# Altium project Project_dot_machne.PrjPcb
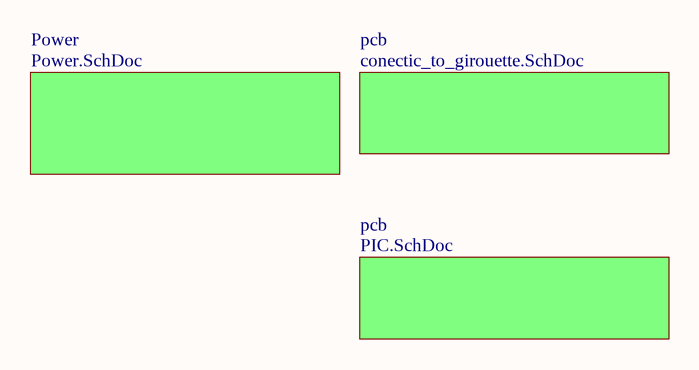
[diagram p0: Sheet1.SchDoc]
4 sheets, 29 parts. Net scope: global (net labels, ports and power ports of the same name join across sheets).
Board files: PCB1.PcbDoc, PCB2.PcbDoc
Sheets:
  Sheet1.SchDoc
    Power = Power.SchDoc
    pcb = conectic_to_girouette.SchDoc
    pcb = PIC.SchDoc

## Sheet Sheet1.SchDoc
size A

### Sub-sheets
pcb = conectic_to_girouette.SchDoc: no entries
pcb = PIC.SchDoc: no entries
Power = Power.SchDoc: no entries

## Sheet Power.SchDoc
size A
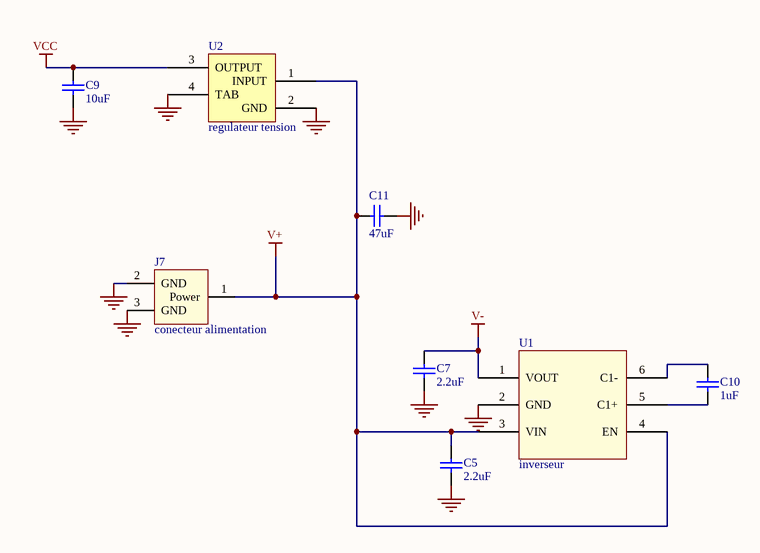
[diagram p1: Power.SchDoc]

### Parts
C5  2.2uF  [CAPC1608X09N]
C7  2.2uF  [CAPC1608X09N]
C9  10uF  [CAPC1608X09N]
C10  1uF  [CAPC1608X09N]
C11  47uF  [CAPC1608X09N]
J7  conecteur alimentation
U1  inverseur
U2  regulateur tension  [SOT230P710X180-4N]

### Nets
GND: C5.1 C7.1 C9.1 C11.1 J7.2(GND) J7.3(GND) U1.2(GND) U2.2(GND) U2.4(TAB)
V+: C5.2 C11.2 J7.1(Power) U1.3(VIN) U1.4(EN) U2.1(INPUT)
V-: C7.2 U1.1(VOUT)
VCC: C9.2 U2.3(OUTPUT)
NetC10_1: C10.1 U1.6(C1-)
NetC10_2: C10.2 U1.5(C1+)

### Library data of the parts
C5 C7 C9-C11 = Cap: Capacitor; Value: 0.1uf; Published: 8-Jun-2000; LatestRevisionDate: 17-Jul-2002; LatestRevisionNote: Re-released for DXP Platform.; PackageReference: RAD-0.3; Publisher: Altium Limited; PackageDescription: Radial Cap, Thru-Hole; 2 Leads; 0.3 in Pin Spacing
U2 = regulateur tension: fournisseur: farnell; Ref fournisseur: 2510013; Ref fabricant: MIC2920A-3.3WS-TR

## Sheet conectic_to_girouette.SchDoc
size B
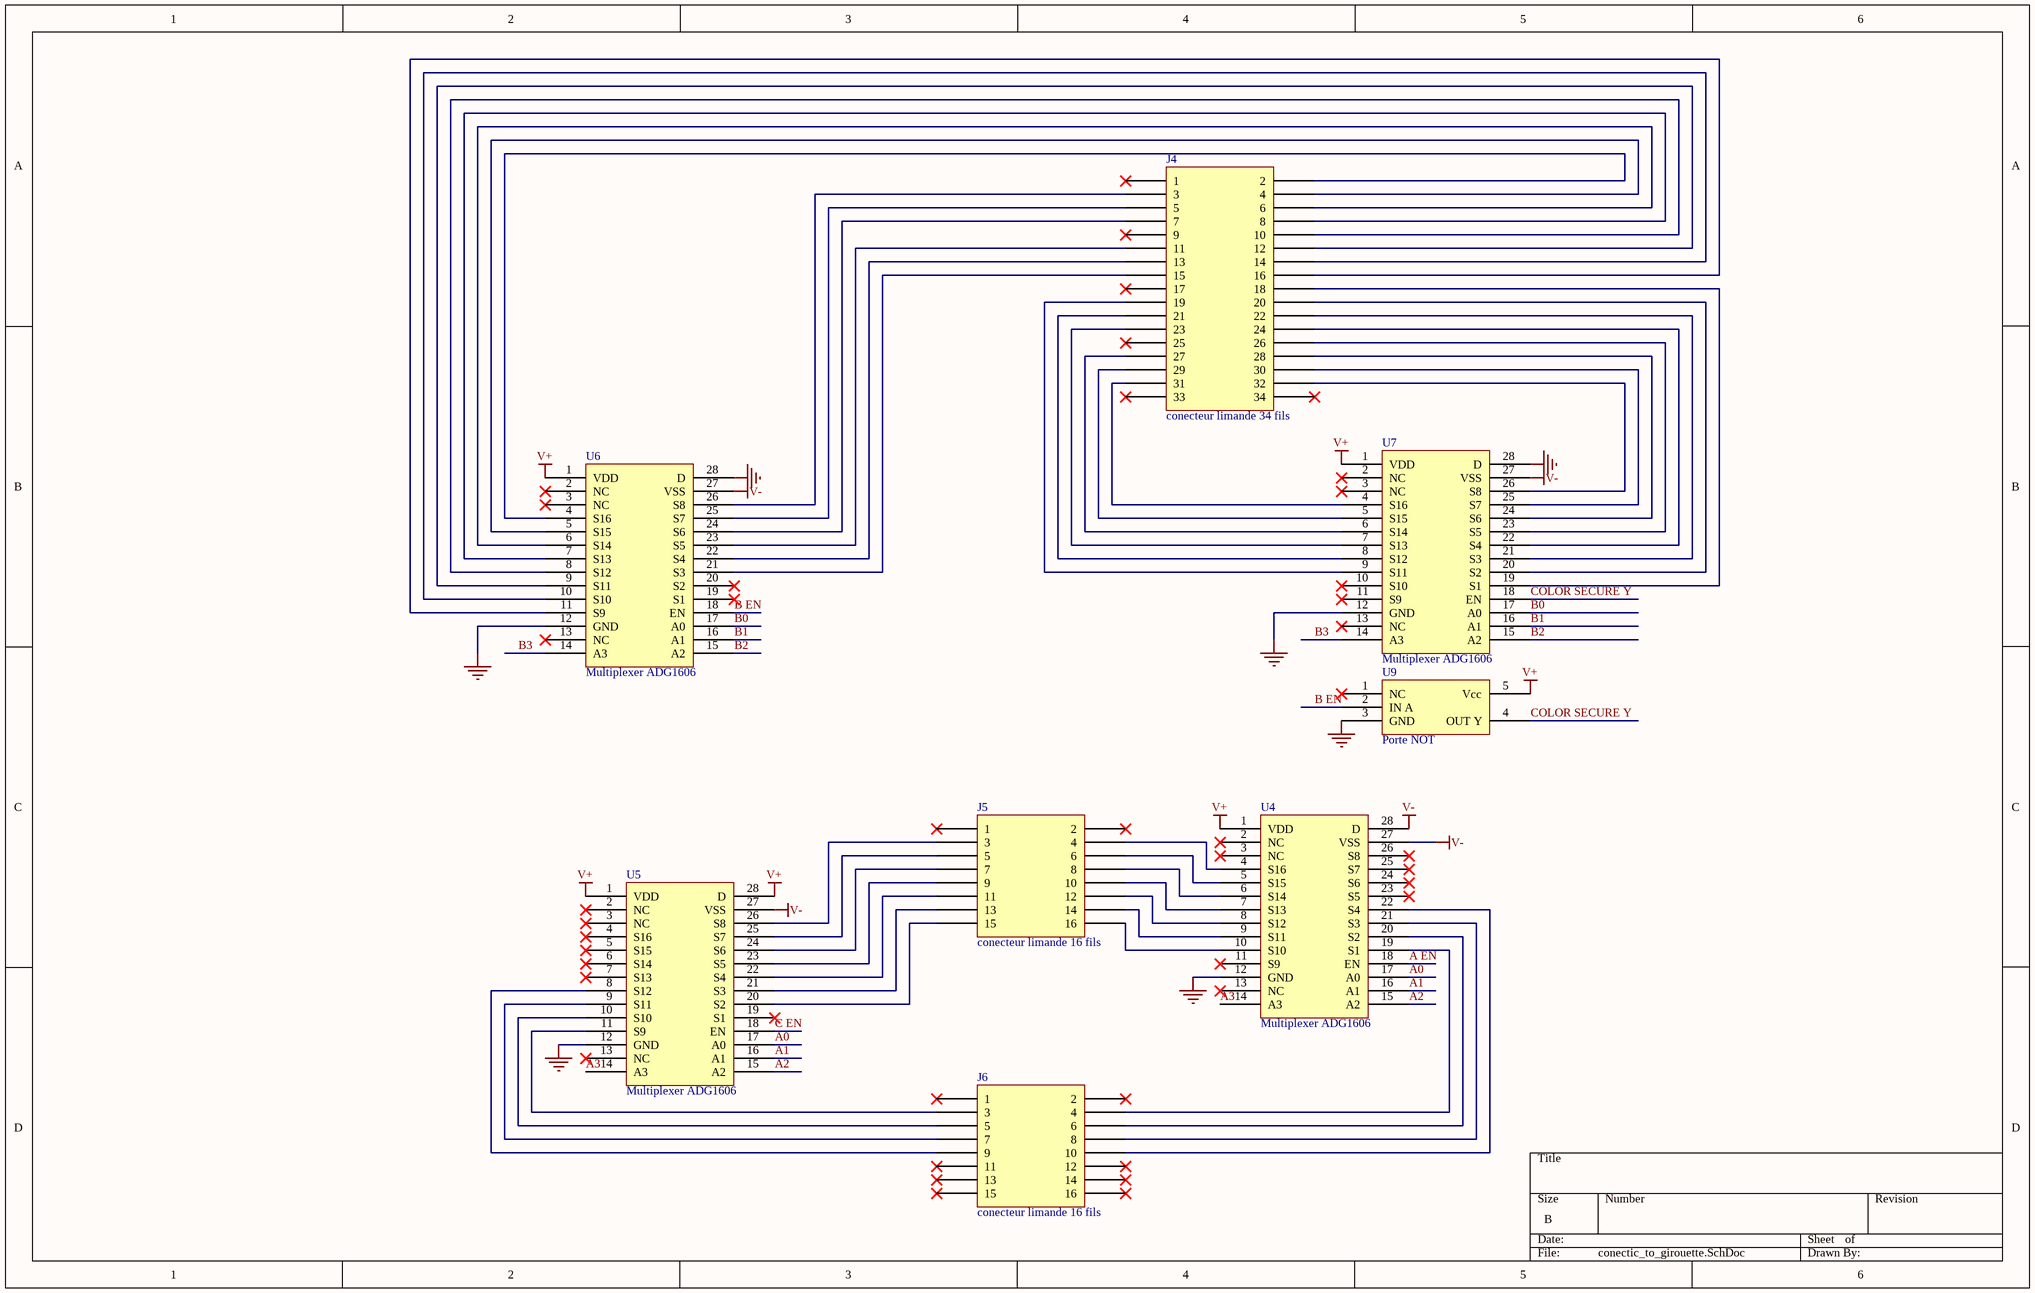
[diagram p2: conectic_to_girouette.SchDoc]

### Parts
J4  conecteur limande 34 fils  [HTSS-117-01-T-DV-P-TR Connecteur 34 pins]
J5  conecteur limande 16 fils  [M80-8541642 connecteur 16 pins]
J6  conecteur limande 16 fils  [M80-8541642 connecteur 16 pins]
U4  Multiplexer ADG1606  [TSOP65P640X120-28N]
U5  Multiplexer ADG1606  [TSOP65P640X120-28N]
U6  Multiplexer ADG1606  [TSOP65P640X120-28N]
U7  Multiplexer ADG1606  [TSOP65P640X120-28N]
U9  Porte NOT  [SOT65P210X110-5N]

### Nets
GND: U4.12(GND) U5.12(GND) U6.12(GND) U6.28(D) U7.12(GND) U7.28(D) U9.3(GND)
V+: U4.1(VDD) U5.1(VDD) U5.28(D) U6.1(VDD) U7.1(VDD) U9.5(Vcc)
V-: U4.27(VSS) U4.28(D) U5.27(VSS) U6.27(VSS) U7.27(VSS)
A0: U4.17(A0) U5.17(A0)
A1: U4.16(A1) U5.16(A1)
A2: U4.15(A2) U5.15(A2)
A3: U4.14(A3) U5.14(A3)
A EN: U4.18(EN)
B0: U6.17(A0) U7.17(A0)
B1: U6.16(A1) U7.16(A1)
B2: U6.15(A2) U7.15(A2)
B3: U6.14(A3) U7.14(A3)
B EN: U6.18(EN) U9.2(IN_A)
C EN: U5.18(EN)
COLOR SECURE Y: U7.18(EN) U9.4(OUT_Y)
NetJ4_2: J4.2 U6.4(S16)
NetJ4_3: J4.3 U6.26(S8)
NetJ4_4: J4.4 U6.5(S15)
NetJ4_5: J4.5 U6.25(S7)
NetJ4_6: J4.6 U6.6(S14)
NetJ4_7: J4.7 U6.24(S6)
NetJ4_8: J4.8 U6.7(S13)
NetJ4_10: J4.10 U6.8(S12)
NetJ4_11: J4.11 U6.23(S5)
NetJ4_12: J4.12 U6.9(S11)
NetJ4_13: J4.13 U6.22(S4)
NetJ4_14: J4.14 U6.10(S10)
NetJ4_15: J4.15 U6.21(S3)
NetJ4_16: J4.16 U6.11(S9)
NetJ4_18: J4.18 U7.19(S1)
NetJ4_19: J4.19 U7.9(S11)
NetJ4_20: J4.20 U7.20(S2)
NetJ4_21: J4.21 U7.8(S12)
NetJ4_22: J4.22 U7.21(S3)
NetJ4_23: J4.23 U7.7(S13)
NetJ4_24: J4.24 U7.22(S4)
NetJ4_26: J4.26 U7.23(S5)
NetJ4_27: J4.27 U7.6(S14)
NetJ4_28: J4.28 U7.24(S6)
NetJ4_29: J4.29 U7.5(S15)
NetJ4_30: J4.30 U7.25(S7)
NetJ4_31: J4.31 U7.4(S16)
NetJ4_32: J4.32 U7.26(S8)
NetJ5_3: J5.3 U5.26(S8)
NetJ5_4: J5.4 U4.4(S16)
NetJ5_5: J5.5 U5.25(S7)
NetJ5_6: J5.6 U4.5(S15)
NetJ5_7: J5.7 U5.24(S6)
NetJ5_8: J5.8 U4.6(S14)
NetJ5_9: J5.9 U5.23(S5)
NetJ5_10: J5.10 U4.7(S13)
NetJ5_11: J5.11 U5.22(S4)
NetJ5_12: J5.12 U4.8(S12)
NetJ5_13: J5.13 U5.21(S3)
NetJ5_14: J5.14 U4.9(S11)
NetJ5_15: J5.15 U5.20(S2)
NetJ5_16: J5.16 U4.10(S10)
NetJ6_3: J6.3 U5.11(S9)
NetJ6_4: J6.4 U4.19(S1)
NetJ6_5: J6.5 U5.10(S10)
NetJ6_6: J6.6 U4.20(S2)
NetJ6_7: J6.7 U5.9(S11)
NetJ6_8: J6.8 U4.21(S3)
NetJ6_9: J6.9 U5.8(S12)
NetJ6_10: J6.10 U4.22(S4)

Not connected (* = marked no-connect by the designer): J4 1* 9* 17* 25* 33* 34*; J5 1* 2*; J6 1* 2* 11* 12* 13* 14* 15* 16*; U4 2(NC)* 3(NC)* 11(S9)* 13(NC)* 23(S5)* 24(S6)* 25(S7)* 26(S8)*; U5 2(NC)* 3(NC)* 4(S16)* 5(S15)* 6(S14)* 7(S13)* 13(NC)* 19(S1)*; U6 2(NC)* 3(NC)* 13(NC)* 19(S1)* 20(S2)*; U7 2(NC)* 3(NC)* 10(S10)* 11(S9)* 13(NC)*; U9 1(NC)*

### Library data of the parts
J4 = Limande 34 fils: fournisseur: Farnell; Ref fabricant: HTSS-117-01-G-D; Ref fournisseur: 1930905
J5 J6 = Connecteur carte a carte: fournisseur: Farnell; Ref fabricant: HTSS-108-02-L-D; Ref fournisseur: 1929447
U4 = Component_1: Ref fabricant: ADG1606BRUZ; Ref fournisseur: 1827328; Fournisseur: Farnell
U5 = Component_1: fournisseur: Farnell; Ref fabricant: ADG1606BRUZ; Ref fournisseur: 1827328
U6 U7 = ADG1606: fournisseur: Farnell; Ref fabricant: ADG1606BRUZ; Ref fournisseur: 1827328
U9 = Porte NOT: fournisseur: Farnell; Ref fabricant: M74VHC1GT04DFT2G; Ref fournisseur: 2464475

## Sheet PIC.SchDoc
size A
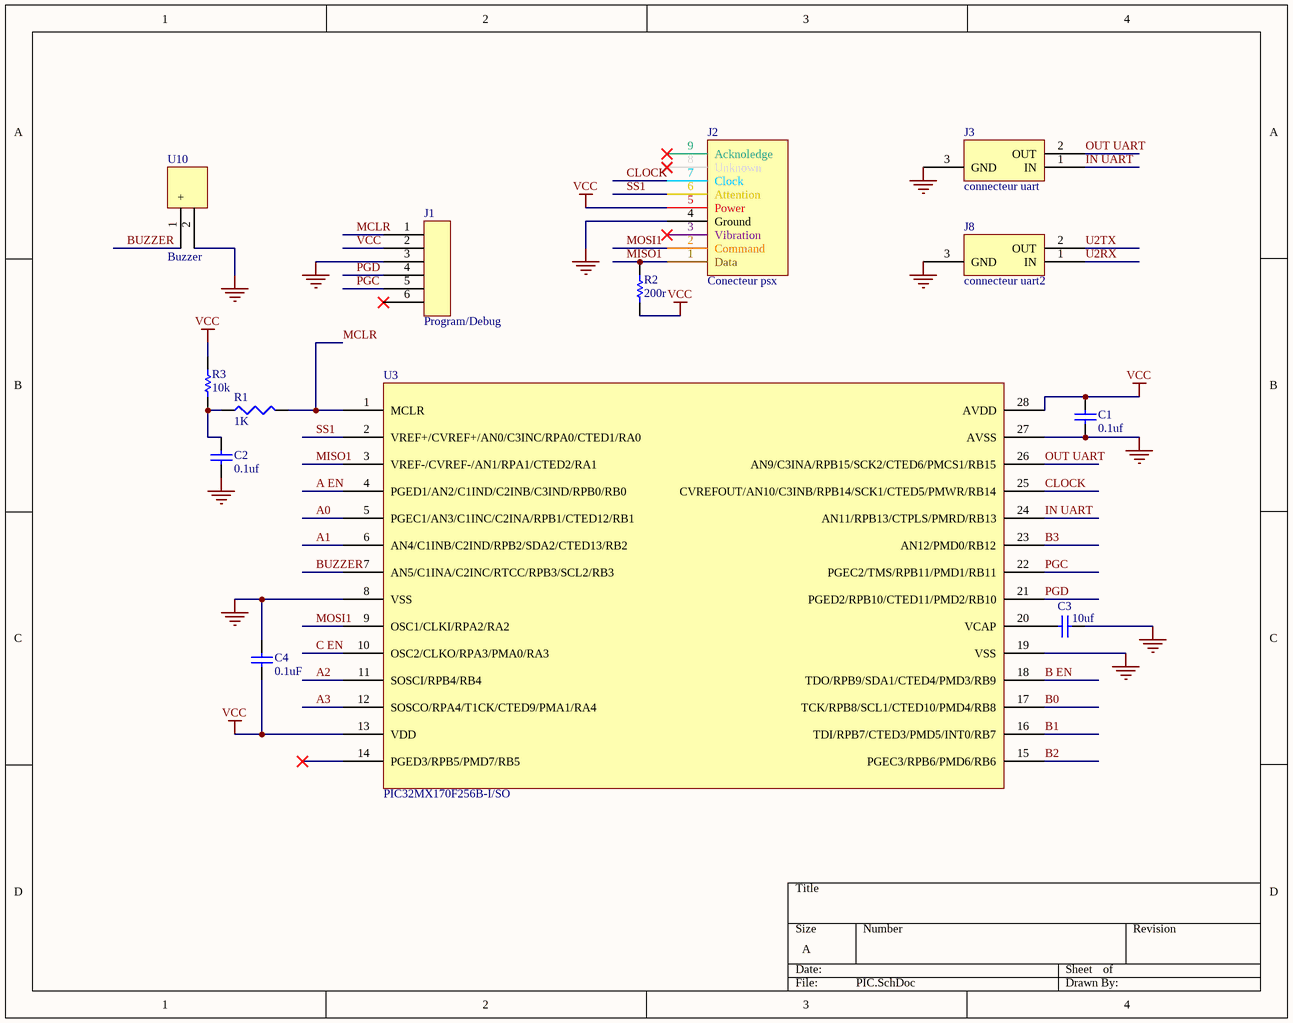
[diagram p3: PIC.SchDoc]

### Parts
C1  0.1uf  [CAPC1608X09N]
C2  0.1uf  [CAPC1608X09N]
C3  10uf  [CAPC1608X09N]
C4  0.1uF  [CAPC1608X09N]
J1  Program/Debug  [Debug]
J2  Conecteur psx  [PCBComponent_1]
J3  connecteur uart  [uart]
J8  connecteur uart2  [uart]
R1  1K  [CAPC1608X09N]
R2  200r  [CAPC1608X09N]
R3  10k  [CAPC1608X09N]
U3  PIC32MX170F256B-I/SO  [SOIC127P1030X265-28N]
U10  Buzzer  [ABT-410-RC]

### Nets
GND: C1.1 C2.1 C3.2 C4.2 J1.3 J2.4(Ground) J3.3(GND) J8.3(GND) U3.8(VSS) U3.19(VSS) U3.27(AVSS) U10.2(-)
VCC: C1.2 C4.1 J1.2 J2.5(Power) R2.1 R3.2 U3.13(VDD) U3.28(AVDD)
A0: U3.5(PGEC1/AN3/C1INC/C2INA/RPB1/CTED12/RB1)
A1: U3.6(AN4/C1INB/C2IND/RPB2/SDA2/CTED13/RB2)
A2: U3.11(SOSCI/RPB4/RB4)
A3: U3.12(SOSCO/RPA4/T1CK/CTED9/PMA1/RA4)
A EN: U3.4(PGED1/AN2/C1IND/C2INB/C3IND/RPB0/RB0)
B0: U3.17(TCK/RPB8/SCL1/CTED10/PMD4/RB8)
B1: U3.16(TDI/RPB7/CTED3/PMD5/INT0/RB7)
B2: U3.15(PGEC3/RPB6/PMD6/RB6)
B3: U3.23(AN12/PMD0/RB12)
B EN: U3.18(TDO/RPB9/SDA1/CTED4/PMD3/RB9)
BUZZER: U3.7(AN5/C1INA/C2INC/RTCC/RPB3/SCL2/RB3) U10.1(+)
C EN: U3.10(OSC2/CLKO/RPA3/PMA0/RA3)
CLOCK: J2.7(Clock) U3.25(CVREFOUT/AN10/C3INB/RPB14/SCK1/CTED5/PMWR/RB14)
IN UART: J3.1(IN) U3.24(AN11/RPB13/CTPLS/PMRD/RB13)
MCLR: J1.1 R1.2 U3.1(MCLR)
MISO1: J2.1(Data) R2.2 U3.3(VREF-/CVREF-/AN1/RPA1/CTED2/RA1)
MOSI1: J2.2(Command) U3.9(OSC1/CLKI/RPA2/RA2)
OUT UART: J3.2(OUT) U3.26(AN9/C3INA/RPB15/SCK2/CTED6/PMCS1/RB15)
PGC: J1.5 U3.22(PGEC2/TMS/RPB11/PMD1/RB11)
PGD: J1.4 U3.21(PGED2/RPB10/CTED11/PMD2/RB10)
SS1: J2.6(Attention) U3.2(VREF+/CVREF+/AN0/C3INC/RPA0/CTED1/RA0)
U2RX: J8.1(IN)
U2TX: J8.2(OUT)
NetC2_2: C2.2 R1.1 R3.1
NetC3_1: C3.1 U3.20(VCAP)

Not connected (* = marked no-connect by the designer): J1 6*; J2 3(Vibration)* 8(Unknown)* 9(Acknoledge)*; U3 14(PGED3/RPB5/PMD7/RB5)*

### Library data of the parts
C1-C4 = Cap: Capacitor; Published: 8-Jun-2000; LatestRevisionDate: 17-Jul-2002; LatestRevisionNote: Re-released for DXP Platform.; PackageReference: RAD-0.3; Publisher: Altium Limited; PackageDescription: Radial Cap, Thru-Hole; 2 Leads; 0.3 in Pin Spacing
  C1 C2 C4: Value: 0.1uf
  C3: Value: 10uf
J1 = Component_1: fournisseur: Farnell; Ref fabricant: 640456-6; Ref fournisseur: 588611
J2 = Component_1: Ref fabricant: 3041438; Ref fournisseur: 1725711; fournisseur: Farnell
J3 J8 = connecteur uart: Ref fournisseur: 1725669; fournisseur: Farnell; Ref fabricant: 3041360
R1 = Res3: Resistor; Published: 8-Jun-2000; LatestRevisionDate: 29-May-2009; LatestRevisionNote: IPC-7351 Footprint Added.; PackageReference: J1-0603; Publisher: Altium Limited; PackageDescription: Chip Resistor; Value: 1K
R2 R3 = Res1: Resistor; Value: 1K; Published: 8-Jun-2000; LatestRevisionDate: 17-Jul-2002; LatestRevisionNote: Re-released for DXP Platform.; PackageReference: AXIAL-0.3; Publisher: Altium Limited; PackageDescription: Axial Device, Thru-Hole; 2 Leads; 0.3 in Pin Spacing
U3 = PICMX1XX: fournisseur: Farnell; Ref fournisseur: 2449077; Ref fabricant: PIC32MX170F256B-I/SO
U10 = Buzzer: fournisseur: Farnell; Ref fournisseur: 1022402; Ref fabricant: ABT-410-RC

## Nets that join several sheets
GND: Power (9 pins), conectic_to_girouette (7 pins), PIC (12 pins)
V+: Power (6 pins), conectic_to_girouette (6 pins)
V-: Power (C7.2 U1.1), conectic_to_girouette (5 pins)
VCC: Power (C9.2 U2.3), PIC (8 pins)
A0: conectic_to_girouette (U4.17 U5.17), PIC (U3.5)
A1: conectic_to_girouette (U4.16 U5.16), PIC (U3.6)
A2: conectic_to_girouette (U4.15 U5.15), PIC (U3.11)
A3: conectic_to_girouette (U4.14 U5.14), PIC (U3.12)
A EN: conectic_to_girouette (U4.18), PIC (U3.4)
B0: conectic_to_girouette (U6.17 U7.17), PIC (U3.17)
B1: conectic_to_girouette (U6.16 U7.16), PIC (U3.16)
B2: conectic_to_girouette (U6.15 U7.15), PIC (U3.15)
B3: conectic_to_girouette (U6.14 U7.14), PIC (U3.23)
B EN: conectic_to_girouette (U6.18 U9.2), PIC (U3.18)
C EN: conectic_to_girouette (U5.18), PIC (U3.10)